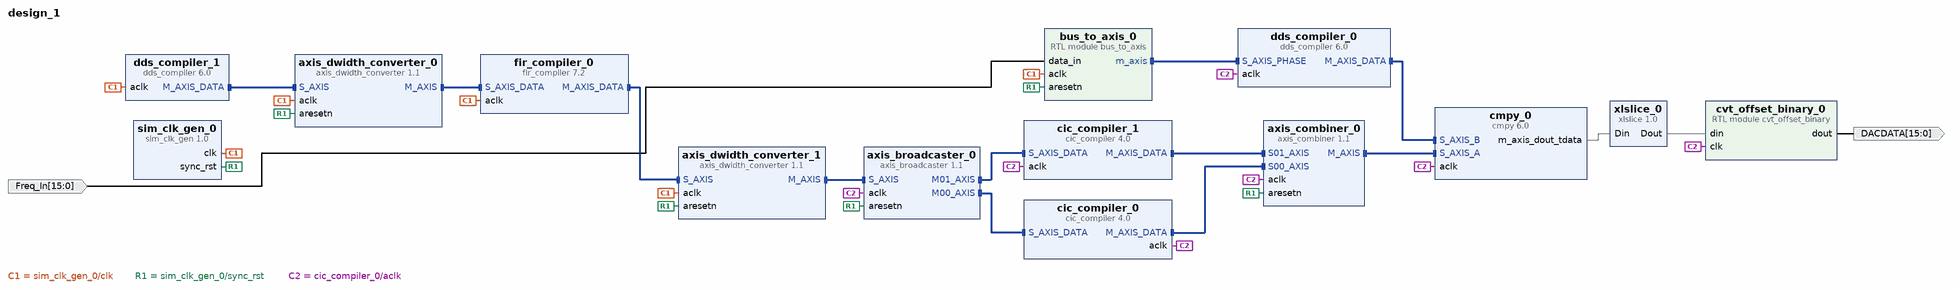
[diagram p0: block diagram of the top level]
# Vivado block design design_1, xczu3eg-sbva484-1-e, Vivado 2019.2
create_bd_design design_1

create_bd_port -dir O -from 15 -to 0 DACDATA
create_bd_port -dir I -from 15 -to 0 Freq_In

create_bd_cell -type ip -vlnv xilinx.com:ip:fir_compiler:7.2 fir_compiler_0
set_property -dict [list \
  CONFIG.Clock_Frequency 122.88 \
  CONFIG.CoefficientSource COE_File \
  CONFIG.Coefficient_File {../../../../../../../FIR filter coefficients.coe} \
  CONFIG.Coefficient_Fractional_Bits 25 \
  CONFIG.Coefficient_Sets 1 \
  CONFIG.Coefficient_Sign Signed \
  CONFIG.Coefficient_Structure Inferred \
  CONFIG.Coefficient_Width 22 \
  CONFIG.DATA_Has_TLAST Not_Required \
  CONFIG.Decimation_Rate 1 \
  CONFIG.Filter_Architecture Systolic_Multiply_Accumulate \
  CONFIG.Filter_Type Interpolation \
  CONFIG.Interpolation_Rate 8 \
  CONFIG.M_DATA_Has_TREADY true \
  CONFIG.M_DATA_Has_TUSER Not_Required \
  CONFIG.Number_Channels 2 \
  CONFIG.Output_Rounding_Mode Symmetric_Rounding_to_Zero \
  CONFIG.Output_Width 20 \
  CONFIG.Quantization Quantize_Only \
  CONFIG.RateSpecification Frequency_Specification \
  CONFIG.S_DATA_Has_TUSER Not_Required \
  CONFIG.Sample_Frequency 0.048 \
  CONFIG.Select_Pattern All \
  CONFIG.Zero_Pack_Factor 1 \
] [get_bd_cells fir_compiler_0]
create_bd_cell -type ip -vlnv xilinx.com:ip:axis_dwidth_converter:1.1 axis_dwidth_converter_0
set_property -dict {CONFIG.S_TDATA_NUM_BYTES 4} [get_bd_cells axis_dwidth_converter_0]
create_bd_cell -type ip -vlnv xilinx.com:ip:axis_dwidth_converter:1.1 axis_dwidth_converter_1
set_property -dict {CONFIG.M_TDATA_NUM_BYTES 6 CONFIG.S_TDATA_NUM_BYTES 3} [get_bd_cells axis_dwidth_converter_1]
create_bd_cell -type ip -vlnv xilinx.com:ip:axis_broadcaster:1.1 axis_broadcaster_0
set_property -dict [list \
  CONFIG.M00_TDATA_REMAP {tdata[23:0]} \
  CONFIG.M01_TDATA_REMAP {tdata[47:24]} \
  CONFIG.M_TDATA_NUM_BYTES 3 \
  CONFIG.S_TDATA_NUM_BYTES 6 \
] [get_bd_cells axis_broadcaster_0]
create_bd_cell -type ip -vlnv xilinx.com:ip:cic_compiler:4.0 cic_compiler_0
set_property -dict [list \
  CONFIG.Clock_Frequency 122.88 \
  CONFIG.HAS_DOUT_TREADY true \
  CONFIG.Input_Data_Width 20 \
  CONFIG.Input_Sample_Frequency 0.384 \
  CONFIG.Number_Of_Stages 6 \
  CONFIG.Output_Data_Width 23 \
  CONFIG.Quantization Truncation \
] [get_bd_cells cic_compiler_0]
create_bd_cell -type ip -vlnv xilinx.com:ip:cic_compiler:4.0 cic_compiler_1
set_property -dict [list \
  CONFIG.Clock_Frequency 122.88 \
  CONFIG.HAS_DOUT_TREADY true \
  CONFIG.Input_Data_Width 20 \
  CONFIG.Input_Sample_Frequency 0.384 \
  CONFIG.Number_Of_Stages 6 \
  CONFIG.Output_Data_Width 23 \
  CONFIG.Quantization Truncation \
] [get_bd_cells cic_compiler_1]
create_bd_cell -type ip -vlnv xilinx.com:ip:axis_combiner:1.1 axis_combiner_0
create_bd_cell -type ip -vlnv xilinx.com:ip:cmpy:6.0 cmpy_0
set_property -dict {CONFIG.APortWidth 23 CONFIG.OutputWidth 16} [get_bd_cells cmpy_0]
create_bd_cell -type ip -vlnv xilinx.com:ip:dds_compiler:6.0 dds_compiler_0
set_property -dict [list \
  CONFIG.DATA_Has_TLAST Not_Required \
  CONFIG.DDS_Clock_Rate 122.88 \
  CONFIG.Frequency_Resolution 0.4 \
  CONFIG.Has_Phase_Out false \
  CONFIG.Has_TREADY true \
  CONFIG.Latency 14 \
  CONFIG.M_DATA_Has_TUSER Not_Required \
  CONFIG.Noise_Shaping Auto \
  CONFIG.Output_Frequency1 0 \
  CONFIG.Output_Width 16 \
  CONFIG.PINC1 0 \
  CONFIG.Phase_Increment Streaming \
  CONFIG.Phase_Width 29 \
  CONFIG.S_PHASE_Has_TUSER Not_Required \
  CONFIG.Spurious_Free_Dynamic_Range 96 \
] [get_bd_cells dds_compiler_0]
create_bd_cell -type ip -vlnv xilinx.com:ip:sim_clk_gen:1.0 sim_clk_gen_0
set_property -dict {CONFIG.FREQ_HZ 122800000 CONFIG.INITIAL_RESET_CLOCK_CYCLES 200} [get_bd_cells sim_clk_gen_0]
create_bd_cell -type ip -vlnv xilinx.com:ip:xlslice:1.0 xlslice_0
set_property -dict {CONFIG.DIN_FROM 15 CONFIG.DOUT_WIDTH 16} [get_bd_cells xlslice_0]
create_bd_cell -type ip -vlnv xilinx.com:ip:dds_compiler:6.0 dds_compiler_1
set_property -dict [list \
  CONFIG.DDS_Clock_Rate 0.048 \
  CONFIG.Frequency_Resolution 0.4 \
  CONFIG.Has_Phase_Out false \
  CONFIG.Has_TREADY true \
  CONFIG.Latency 10 \
  CONFIG.M_DATA_Has_TUSER Not_Required \
  CONFIG.Noise_Shaping Auto \
  CONFIG.Output_Frequency1 0.01 \
  CONFIG.Output_Width 16 \
  CONFIG.PINC1 110101010101010 \
  CONFIG.Phase_Width 17 \
  CONFIG.Spurious_Free_Dynamic_Range 96 \
] [get_bd_cells dds_compiler_1]
create_bd_cell -type module -reference bus_to_axis bus_to_axis_0
create_bd_cell -type module -reference cvt_offset_binary cvt_offset_binary_0

# ---- connections ----

connect_bd_intf_net [get_bd_intf_pins axis_dwidth_converter_0/M_AXIS] [get_bd_intf_pins fir_compiler_0/S_AXIS_DATA]
connect_bd_intf_net [get_bd_intf_pins axis_broadcaster_0/M00_AXIS] [get_bd_intf_pins cic_compiler_0/S_AXIS_DATA]
connect_bd_intf_net [get_bd_intf_pins dds_compiler_0/M_AXIS_DATA] [get_bd_intf_pins cmpy_0/S_AXIS_B]
connect_bd_intf_net [get_bd_intf_pins dds_compiler_1/M_AXIS_DATA] [get_bd_intf_pins axis_dwidth_converter_0/S_AXIS]
connect_bd_intf_net [get_bd_intf_pins axis_dwidth_converter_1/M_AXIS] [get_bd_intf_pins axis_broadcaster_0/S_AXIS]
connect_bd_intf_net [get_bd_intf_pins cic_compiler_0/M_AXIS_DATA] [get_bd_intf_pins axis_combiner_0/S00_AXIS]
connect_bd_intf_net [get_bd_intf_pins fir_compiler_0/M_AXIS_DATA] [get_bd_intf_pins axis_dwidth_converter_1/S_AXIS]
connect_bd_intf_net [get_bd_intf_pins axis_combiner_0/M_AXIS] [get_bd_intf_pins cmpy_0/S_AXIS_A]
connect_bd_intf_net [get_bd_intf_pins axis_combiner_0/S01_AXIS] [get_bd_intf_pins cic_compiler_1/M_AXIS_DATA]
connect_bd_intf_net [get_bd_intf_pins bus_to_axis_0/m_axis] [get_bd_intf_pins dds_compiler_0/S_AXIS_PHASE]
connect_bd_intf_net [get_bd_intf_pins axis_broadcaster_0/M01_AXIS] [get_bd_intf_pins cic_compiler_1/S_AXIS_DATA]
connect_bd_net [get_bd_pins sim_clk_gen_0/clk] \
  [get_bd_pins axis_dwidth_converter_1/aclk] [get_bd_pins fir_compiler_0/aclk] [get_bd_pins axis_dwidth_converter_0/aclk] \
  [get_bd_pins dds_compiler_1/aclk] [get_bd_pins bus_to_axis_0/aclk]
connect_bd_net [get_bd_pins sim_clk_gen_0/sync_rst] \
  [get_bd_pins axis_dwidth_converter_0/aresetn] [get_bd_pins axis_dwidth_converter_1/aresetn] \
  [get_bd_pins axis_broadcaster_0/aresetn] [get_bd_pins axis_combiner_0/aresetn] [get_bd_pins bus_to_axis_0/aresetn]
connect_bd_net [get_bd_pins cic_compiler_0/aclk] \
  [get_bd_pins cic_compiler_1/aclk] [get_bd_pins axis_broadcaster_0/aclk] [get_bd_pins axis_combiner_0/aclk] \
  [get_bd_pins cmpy_0/aclk] [get_bd_pins dds_compiler_0/aclk] [get_bd_pins cvt_offset_binary_0/clk]
connect_bd_net [get_bd_pins cmpy_0/m_axis_dout_tdata] [get_bd_pins xlslice_0/Din]
connect_bd_net [get_bd_pins xlslice_0/Dout] [get_bd_pins cvt_offset_binary_0/din]
connect_bd_net [get_bd_pins cvt_offset_binary_0/dout] [get_bd_ports DACDATA]
connect_bd_net [get_bd_ports Freq_In] [get_bd_pins bus_to_axis_0/data_in]

validate_bd_design
save_bd_design
